# Altium schematic sheet Sheet_1_2021-06-25.schdoc
size 389 x 200 mm
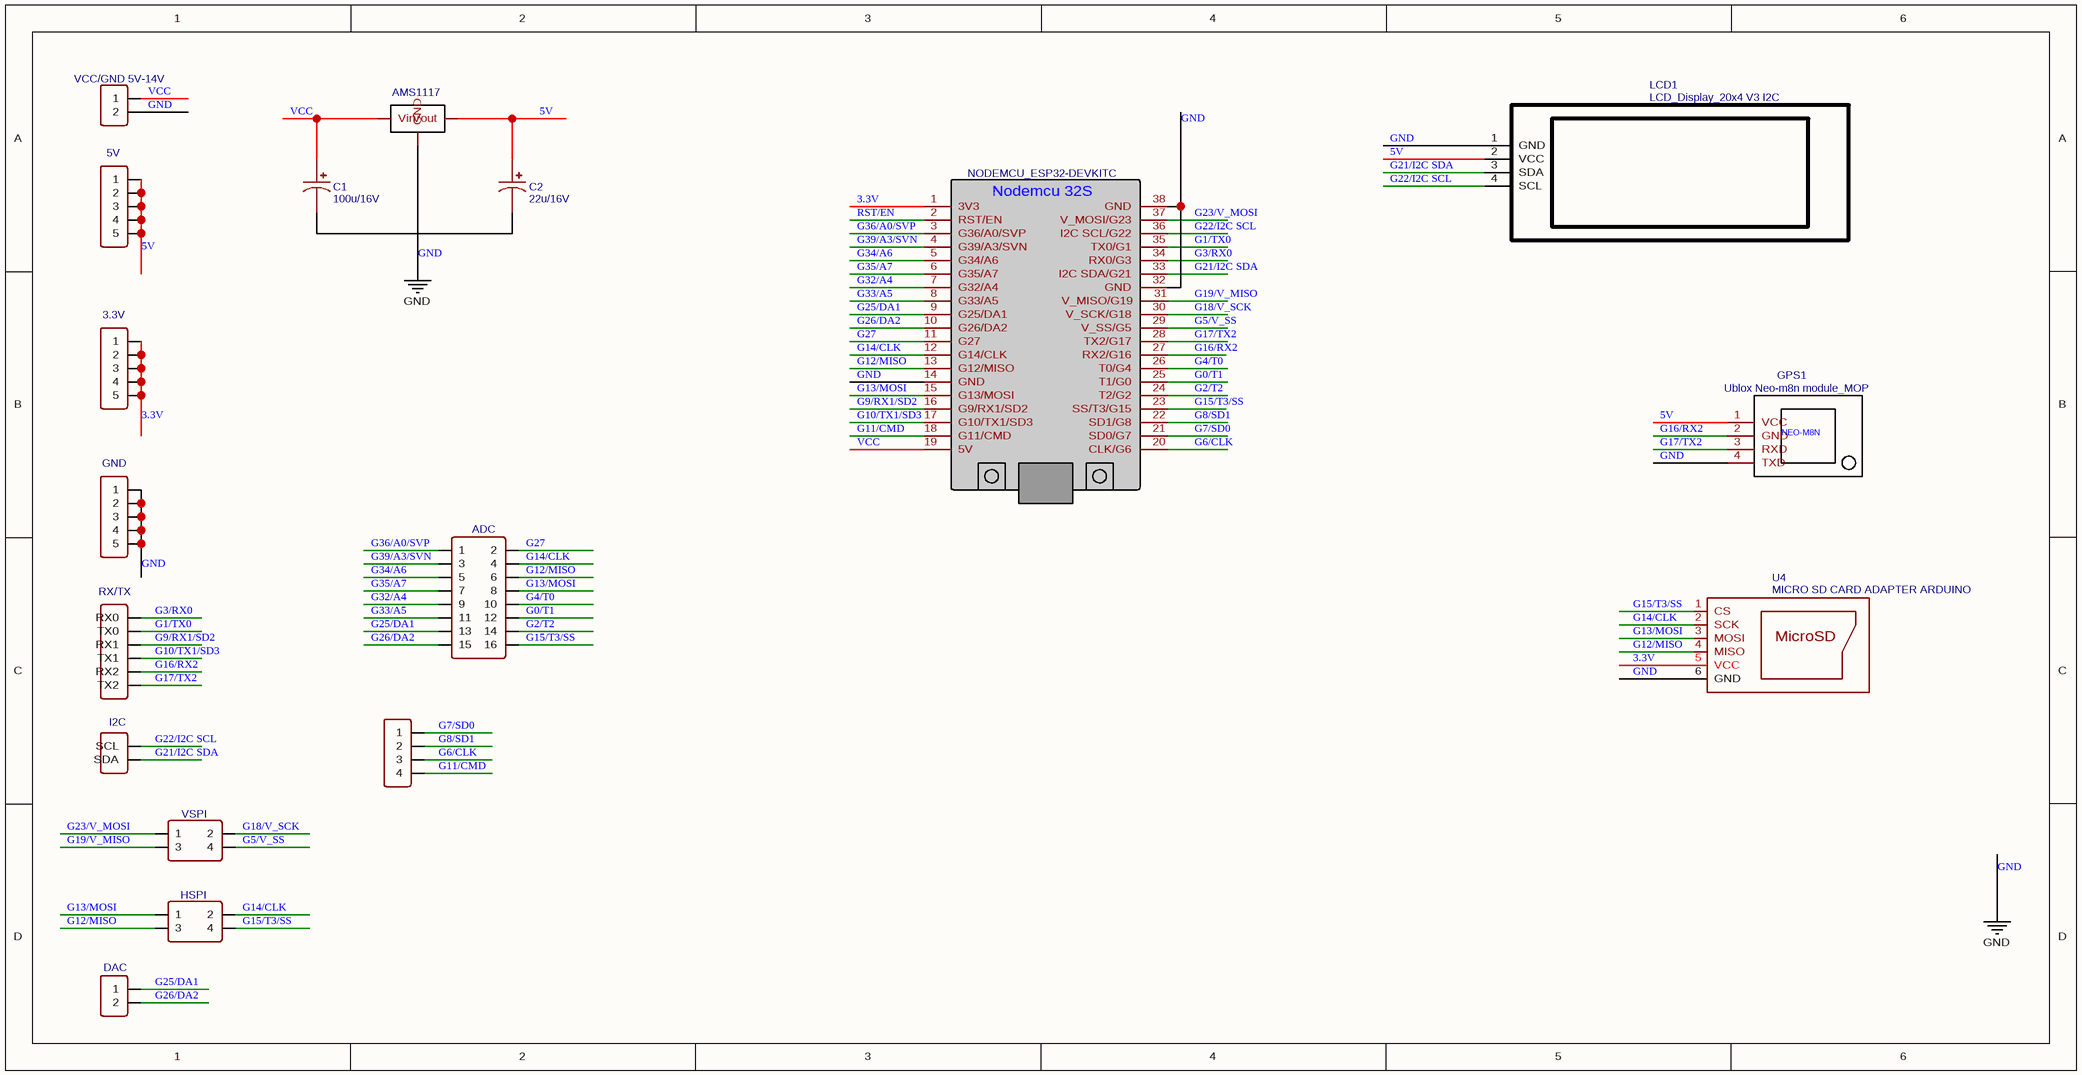
[diagram p0: Sheet_1_2021-06-25.schdoc]

## Parts
3.3V  3.3V  [HDR-M-2.54_1X5]  (value not drawn)
5V  5V  [HDR-M-2.54_1X5]  (value not drawn)
ADC  ADC  [HDR-M-2.54_2X8]
C1  100u/16V  [CASE-A_3216]
C2  22u/16V  [CASE-A_3216]
DAC  DAC  [HDR-M-2.54_1X2]
GND  GND  [HDR-M-2.54_1X5]  (value not drawn)
GPS1  Ublox Neo-m8n module_MOP  [UBLOX_NEO-6M_GPS_MODULE]
HSPI  HDR-M-2.54_2x2  [HDR-M-2.54_2X2]  (value not drawn)
I2C  HDR-M-2.54_1x2  [HDR-M-2.54_1X2]  (value not drawn)
J4  HDR-M-2.54_1x4  [HDR-M-2.54_1X4]  (value not drawn)
LCD1  LCD_Display_20x4 V3 I2C  [LCD_2004_4-8BIT_IF LCD_2004_4-8BIT_IF V4 I2C]
RX/TX  RX/TX  [HDR-M-2.54_1X6]  (value not drawn)
U1  NODEMCU_ESP32-DEVKITC  [NODEMCU-ESP32S]
U3  AMS1117  [AMS1117]
U4  MICRO SD CARD ADAPTER ARDUINO  [MICROSD CARD ADAPTER (PFQ)]
VCC  VCC/GND 5V-14V  [HDR-M-2.54_1X2]
VSPI  HDR-M-2.54_2x2  [HDR-M-2.54_2X2]  (value not drawn)

## Nets
GND: GND.1 GND.2 GND.3 GND.4 GND.5 GPS1.4(TXD) LCD1.1(GND) U1.14(GND) U1.32(GND) U1.38(GND) U3.1(GND) U4.6(GND) VCC.2
3.3V: 3.3V.1 3.3V.2 3.3V.3 3.3V.4 3.3V.5 U1.1(3V3) U4.5(VCC)
5V: 5V.1 5V.2 5V.3 5V.4 5V.5 C2.1 GPS1.1(VCC) LCD1.2(VCC) U3.2(Vout)
G0/T1: ADC.12 U1.25(T1/G0)
G1/TX0: RX/TX.2(TX0) U1.35(TX0/G1)
G2/T2: ADC.14 U1.24(T2/G2)
G3/RX0: RX/TX.1(RX0) U1.34(RX0/G3)
G4/T0: ADC.10 U1.26(T0/G4)
G5/V_SS: U1.29(V_SS/G5) VSPI.4
G6/CLK: J4.3 U1.20(CLK/G6)
G7/SD0: J4.1 U1.21(SD0/G7)
G8/SD1: J4.2 U1.22(SD1/G8)
G9/RX1/SD2: RX/TX.3(RX1) U1.16(G9/RX1/SD2)
G10/TX1/SD3: RX/TX.4(TX1) U1.17(G10/TX1/SD3)
G11/CMD: J4.4 U1.18(G11/CMD)
G12/MISO: ADC.6 HSPI.3 U1.13(G12/MISO) U4.4(MISO)
G13/MOSI: ADC.8 HSPI.1 U1.15(G13/MOSI) U4.3(MOSI)
G14/CLK: ADC.4 HSPI.2 U1.12(G14/CLK) U4.2(SCK)
G15/T3/SS: ADC.16 HSPI.4 U1.23(SS/T3/G15) U4.1(CS)
G16/RX2: GPS1.2(GND) RX/TX.5(RX2) U1.27(RX2/G16)
G17/TX2: GPS1.3(RXD) RX/TX.6(TX2) U1.28(TX2/G17)
G18/V_SCK: U1.30(V_SCK/G18) VSPI.2
G19/V_MISO: U1.31(V_MISO/G19) VSPI.3
G21/I2C SDA: I2C.2(SDA) LCD1.3(SDA) U1.33(I2C_SDA/G21)
G22/I2C SCL: I2C.1(SCL) LCD1.4(SCL) U1.36(I2C_SCL/G22)
G23/V_MOSI: U1.37(V_MOSI/G23) VSPI.1
G25/DA1: ADC.13 DAC.1 U1.9(G25/DA1)
G26/DA2: ADC.15 DAC.2 U1.10(G26/DA2)
G27: ADC.2 U1.11(G27)
G32/A4: ADC.9 U1.7(G32/A4)
G33/A5: ADC.11 U1.8(G33/A5)
G34/A6: ADC.5 U1.5(G34/A6)
G35/A7: ADC.7 U1.6(G35/A7)
G36/A0/SVP: ADC.1 U1.3(G36/A0/SVP)
G39/A3/SVN: ADC.3 U1.4(G39/A3/SVN)
RST/EN: U1.2(RST/EN)
VCC: C1.1 U1.19(5V) U3.3(Vin) VCC.1
NetC1_2: C1.2 C2.2

## Notes on the sheet
- (in symbol MICRO SD CARD ADAPTER ARDUINO) MicroSD
- (in symbol NODEMCU_ESP32-DEVKITC) Nodemcu 32S
- (in symbol Ublox Neo-m8n module_MOP) NEO-M8N

## Library data of the parts
3.3V = 3.3V: Contributor: LCEDA_Lib; BOM_Supplier Part: C358687; BOM_Supplier: LCSC; spicePre: J; spiceSymbolName: HDR-M-2.54_1x5
5V = 5V: Contributor: LCEDA_Lib; BOM_Supplier Part: C358687; BOM_Supplier: LCSC; spicePre: J; spiceSymbolName: HDR-M-2.54_1x5
ADC = ADC: Contributor: LCEDA_Lib; BOM_Supplier Part: C68234; BOM_Supplier: LCSC; spicePre: J; spiceSymbolName: HDR-M-2.54_2x8
C1 = 100u/16V: nameAlias: Value(F); Contributor: LCEDA_Lib; spicePre: C; spiceSymbolName: C_Tan_SMD_A_US
C2 = 22u/16V: nameAlias: Value(F); Contributor: LCEDA_Lib; spicePre: C; spiceSymbolName: C_Tan_SMD_A_US
DAC = DAC: Contributor: LCEDA_Lib; BOM_Supplier Part: C124375; BOM_Supplier: LCSC; spicePre: J; spiceSymbolName: HDR-M-2.54_1x2
GND = GND: Contributor: LCEDA_Lib; BOM_Supplier Part: C358687; BOM_Supplier: LCSC; spicePre: J; spiceSymbolName: HDR-M-2.54_1x5
GPS1 = Ublox Neo-m8n module_MOP: Contributor: hasimkhan; BOM_Supplier: eBay; BOM_Supplier Part: -; spicePre: G; spiceSymbolName: Ublox Neo-m8n module_MOP
HSPI VSPI = HDR-M-2.54_2x2: Contributor: LCEDA_Lib; BOM_Supplier Part: C66690; BOM_Supplier: LCSC; spicePre: J; spiceSymbolName: HDR-M-2.54_2x2
I2C = HDR-M-2.54_1x2: Contributor: LCEDA_Lib; BOM_Supplier Part: C124375; BOM_Supplier: LCSC; spicePre: J; spiceSymbolName: HDR-M-2.54_1x2
J4 = HDR-M-2.54_1x4: Contributor: LCEDA_Lib; BOM_Supplier Part: C124378; BOM_Supplier: LCSC; spicePre: J; spiceSymbolName: HDR-M-2.54_1x4
LCD1 = LCD_Display_20x4 V3 I2C: sourceId: yDLFXRL3l; BOM_15: A; Contributor: Heubeul; timeStamp: 1463852695; spicePre: L; spiceSymbolName: LCD_Display_20x4 V3 I2C
RX/TX = RX/TX: Contributor: LCEDA_Lib; BOM_Supplier Part: C190819; BOM_Supplier: LCSC; spicePre: J; spiceSymbolName: HDR-M-2.54_1x6
U1 = NODEMCU_ESP32-DEVKITC: BOM_Manufacturer Part: NodeMCU ESP32S-----; Contributor: andzej.telican; spicePre: U; spiceSymbolName: NODEMCU_ESP32-DEVKITC
U3 = AMS1117: Contributor: Gremlinware; BOM_Supplier: Amish; BOM_Supplier Part: HLK-PM01; spicePre: U; spiceSymbolName: AMS1117
U4 = MICRO SD CARD ADAPTER ARDUINO: Contributor: Laika; BOM_Manufacturer Part: MicroSD Card Adapter; spicePre: U; spiceSymbolName: MICRO SD CARD ADAPTER ARDUINO
VCC = VCC/GND 5V-14V: Contributor: LCEDA_Lib; BOM_Supplier Part: C124375; BOM_Supplier: LCSC; spicePre: J; spiceSymbolName: HDR-M-2.54_1x2